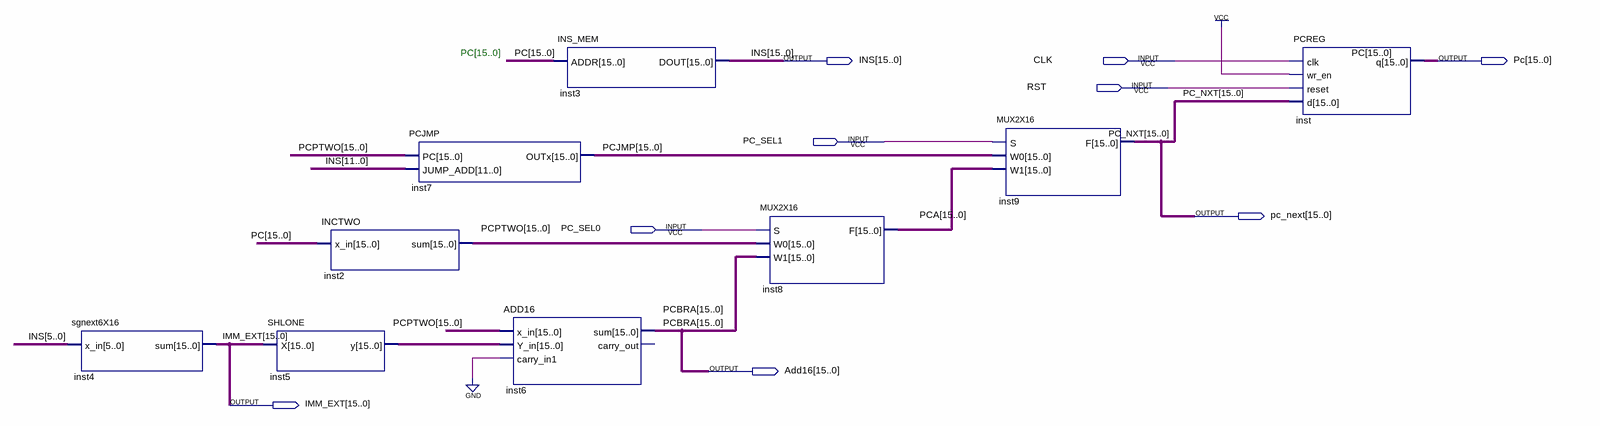
[diagram p0: schematic sheet]
// Quartus schematic M16DP1.bdf as structural Verilog: 9 symbols, 9 pins
module M16DP1 (
  input  CLK,
  input  RST,
  input  PC_SEL1,
  input  PC_SEL0,
  output [15:0] INS,
  output [15:0] Pc,
  output [15:0] pc_next,
  output [15:0] Add16,
  output [15:0] IMM_EXT
);

  wire [15:0] inst5_y, PCA, PCJMP, PCPTWO;

  sgnext6X16 inst4 (.x_in(INS[5:0]), .sum(IMM_EXT));
  SHLONE inst5 (.X(IMM_EXT), .y(inst5_y));
  INCTWO inst2 (.x_in(Pc), .sum(PCPTWO));
  PCJMP inst7 (.PC(PCPTWO), .JUMP_ADD(INS[11:0]), .OUTx(PCJMP));
  ADD16 inst6 (.x_in(PCPTWO), .Y_in(inst5_y), .carry_in1(1'b0), .sum(Add16));  // open: carry_out
  INS_MEM inst3 (.ADDR(Pc), .DOUT(INS));
  MUX2X16 inst8 (.S(PC_SEL0), .W0(PCPTWO), .W1(Add16), .F(PCA));
  MUX2X16 inst9 (.S(PC_SEL1), .W0(PCJMP), .W1(PCA), .F(pc_next));
  PCREG inst (.clk(CLK), .wr_en(1'b1), .reset(RST), .d(pc_next), .q(Pc));

  // Other names for the same wires on the sheet: PCBRA[15:0] = Add16; PC_NXT[15:0] = pc_next

  // Notes on the sheet:
  //   PC[15..0]
endmodule
